# Altium schematic sheet STM32G431CBT6.SchDoc
size 762 x 381 mm; SheetNumber: 4; SheetTotal: 8
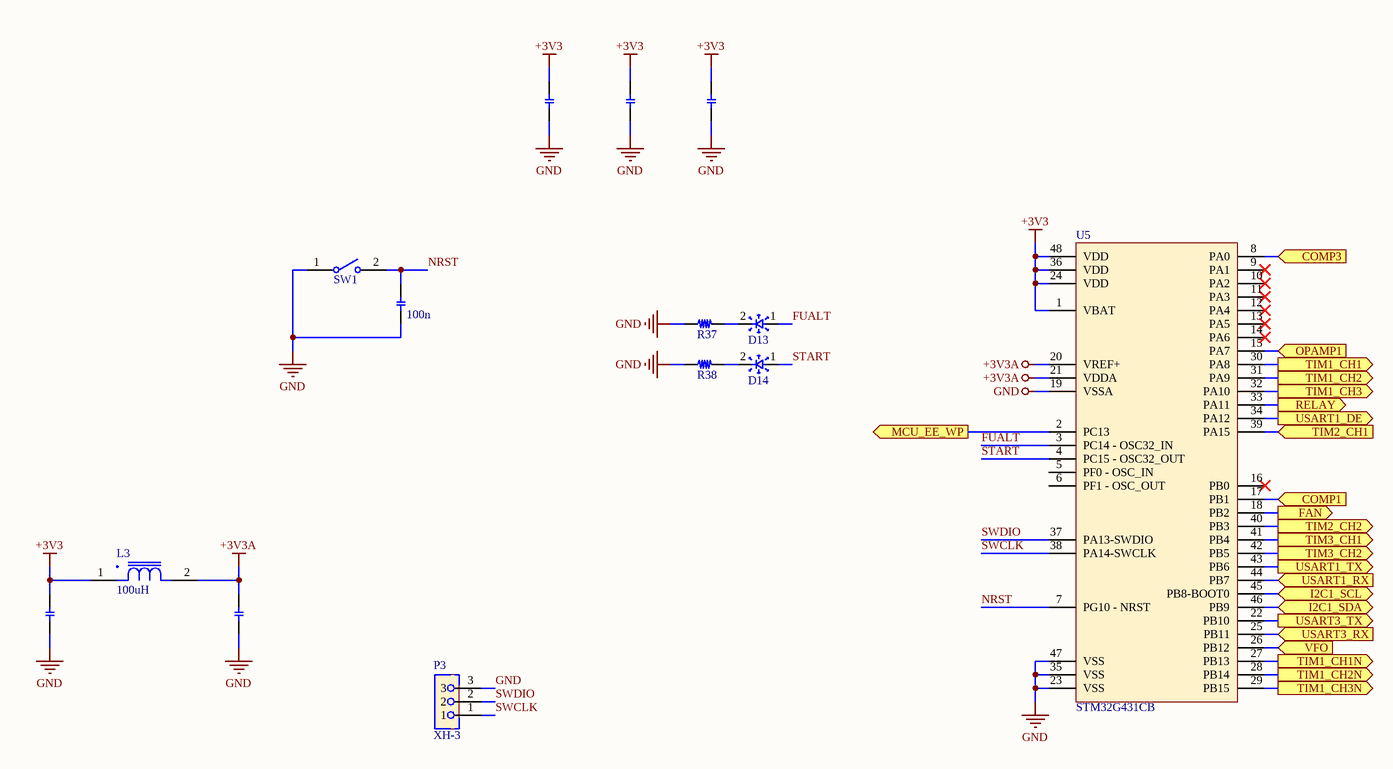
[diagram p0: STM32G431CBT6.SchDoc]

## Parts
C40  CAP_SMD  [C 0603]  (value not drawn)
C41  CAP_SMD  [C 0603]  (value not drawn)
C42  CAP_SMD  [C 0603]  (value not drawn)
C43  100n  [C 0603]
C44  CAP_SMD  [C 0603]  (value not drawn)
C45  CAP_SMD  [C 0603]  (value not drawn)
D13  LED_SMD  [D 0603]  (value not drawn)
D14  LED_SMD  [D 0603]  (value not drawn)
L3  100uH  [L 0805]
P3  XH-3  [XH-3]
R37  RES_SMD  [R 0603]  (value not drawn)
R38  RES_SMD  [R 0603]  (value not drawn)
SW1  434121043836  [WS-TASV_L6W3.5H4.3_4341x10438x6]  (value not drawn)
U5  STM32G431CB  [QFP-48]

## Ports
COMP1 (in), COMP3 (in), FAN (out), I2C1_SCL (bidir), I2C1_SDA (bidir), MCU_EE_WP (out), OPAMP1 (in), RELAY (out), TIM1_CH1 (out), TIM1_CH1N (out), TIM1_CH2 (out), TIM1_CH2N (out), TIM1_CH3 (out), TIM1_CH3N (out), TIM2_CH1 (in), TIM2_CH2 (out), TIM3_CH1 (out), TIM3_CH2 (out), USART1_DE (out), USART1_RX (in), USART1_TX (out), USART3_RX (in), USART3_TX (out), VFO (in)

## Nets
+3V3: C40.2 C41.2 C42.2 C44.2 L3.1 U5.1(VBAT) U5.24(VDD) U5.36(VDD) U5.48(VDD)
+3V3A: C45.2 L3.2 U5.20(VREF+) U5.21(VDDA)
GND: C40.1 C41.1 C42.1 C43.1 C44.1 C45.1 P3.3 R37.1 R38.1 SW1.1 U5.19(VSSA) U5.23(VSS) U5.35(VSS) U5.47(VSS)
COMP1: U5.17(PB1) ; port COMP1
COMP3: U5.8(PA0) ; port COMP3
FAN: U5.18(PB2) ; port FAN
FUALT: D13.1 U5.3(PC14_-_OSC32_IN)
I2C1_SCL: U5.45(PB8-BOOT0) ; port I2C1_SCL
I2C1_SDA: U5.46(PB9) ; port I2C1_SDA
MCU_EE_WP: U5.2(PC13) ; port MCU_EE_WP
NRST: C43.2 SW1.2 U5.7(PG10_-_NRST)
OPAMP1: U5.15(PA7) ; port OPAMP1
RELAY: U5.33(PA11) ; port RELAY
START: D14.1 U5.4(PC15_-_OSC32_OUT)
SWCLK: P3.1 U5.38(PA14-SWCLK)
SWDIO: P3.2 U5.37(PA13-SWDIO)
TIM1_CH1: U5.30(PA8) ; port TIM1_CH1
TIM1_CH1N: U5.27(PB13) ; port TIM1_CH1N
TIM1_CH2: U5.31(PA9) ; port TIM1_CH2
TIM1_CH2N: U5.28(PB14) ; port TIM1_CH2N
TIM1_CH3: U5.32(PA10) ; port TIM1_CH3
TIM1_CH3N: U5.29(PB15) ; port TIM1_CH3N
TIM2_CH1: U5.39(PA15) ; port TIM2_CH1
TIM2_CH2: U5.40(PB3) ; port TIM2_CH2
TIM3_CH1: U5.41(PB4) ; port TIM3_CH1
TIM3_CH2: U5.42(PB5) ; port TIM3_CH2
USART1_DE: U5.34(PA12) ; port USART1_DE
USART1_RX: U5.44(PB7) ; port USART1_RX
USART1_TX: U5.43(PB6) ; port USART1_TX
USART3_RX: U5.25(PB11) ; port USART3_RX
USART3_TX: U5.22(PB10) ; port USART3_TX
VFO: U5.26(PB12) ; port VFO
NetD13_2: D13.2 R37.2
NetD14_2: D14.2 R38.2

Not connected (* = marked no-connect by the designer): U5 5(PF0_-_OSC_IN) 6(PF1_-_OSC_OUT) 9(PA1)* 10(PA2)* 11(PA3)* 12(PA4)* 13(PA5)* 14(PA6)* 16(PB0)*

## Library data of the parts
C43 = CAP_SMD
L3 = Inductor
SW1 = 434121043836: WS-TASV SMT Tact Switch, L6 x W3.5 x H4.3mm, 360g, SPST-NO, 12V, 50mA; Manufacturer: Wurth Elektronik; Washable: No; Manufacturer Part Number: 434121043836; Category: Tact Switches; Match Code: WS-TASV; ComponentLink1Description: Website Link; ComponentLink1URL: https://www.we-online.com/redexpert/article/434121043836?ad; ComponentLink2Description: Datasheet Link; ComponentLink2URL: https://www.we-online.com/redexpert/spec/434121043836?ad; Mount: Surface Mount; Operating Temperature Max: 85°C; Operating Temperature Min: -40°C; Packaging: Tape and Reel; Length: 6mm; Width: 3.5mm; Height: 4.3mm; Circuit: SPST-NO; Contact Material: Stainless Steel; Contact Plating: Silver; Operation Force: 360g; Rated Current: 50mA; Rated Voltage (DC): 12V; Terminal Material: Copper Alloy; Terminal Plating: Silver